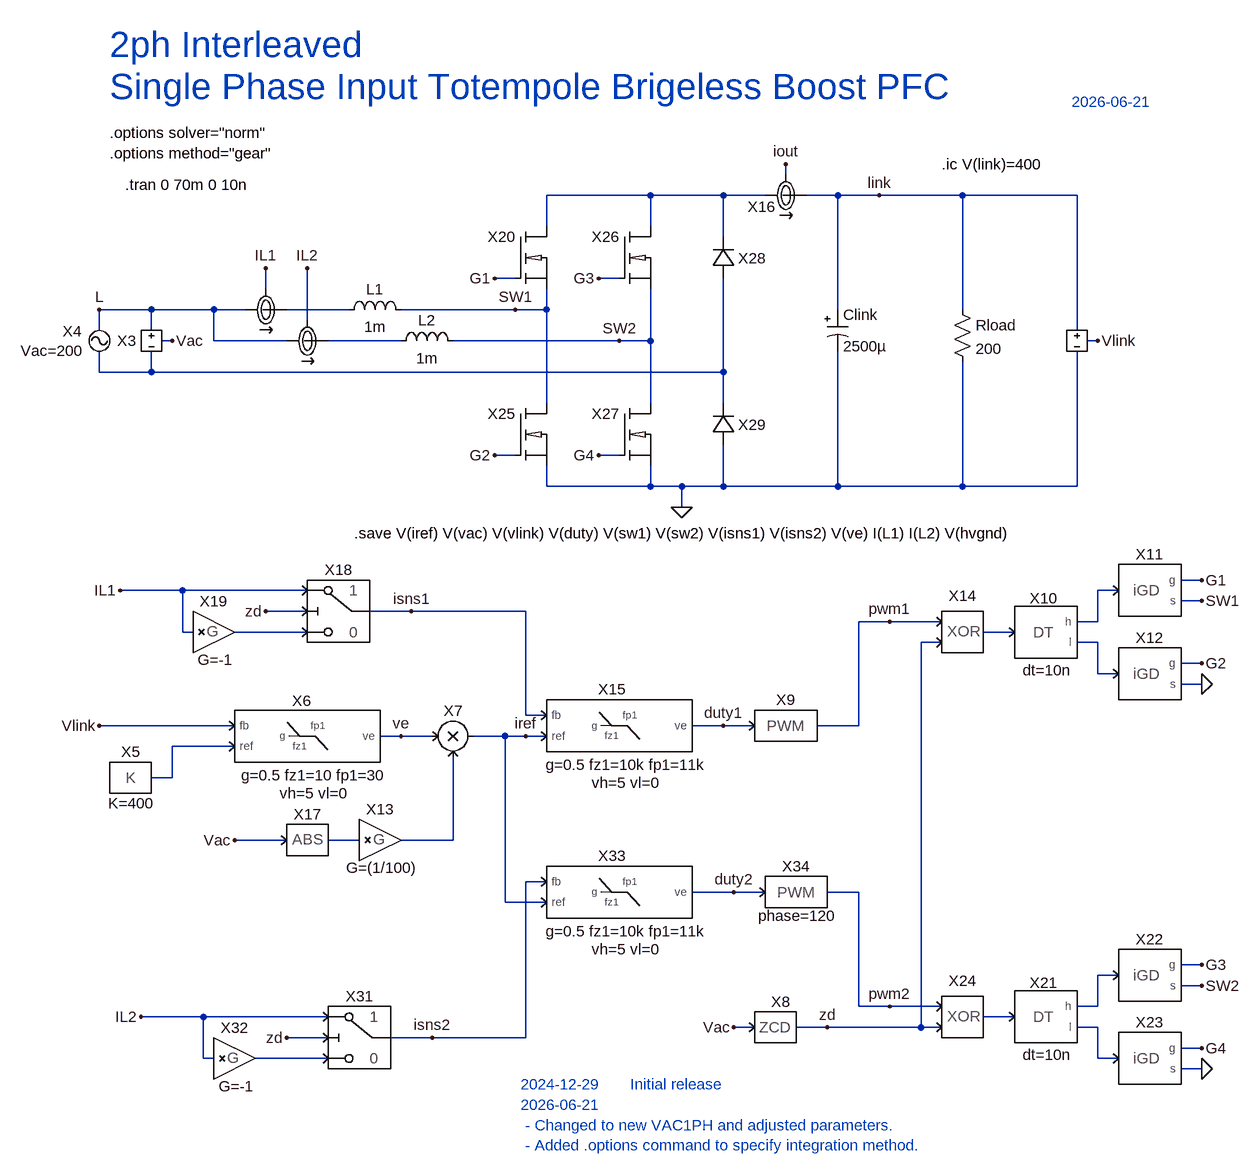
[diagram p0: schematic 1Ph-TTP-PFC_2ITLV.asc]
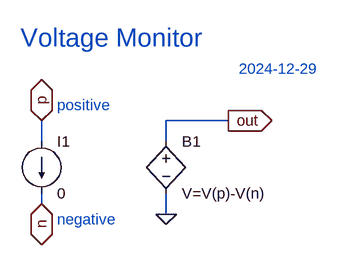
[diagram p1: sub-circuit vmon.asc]
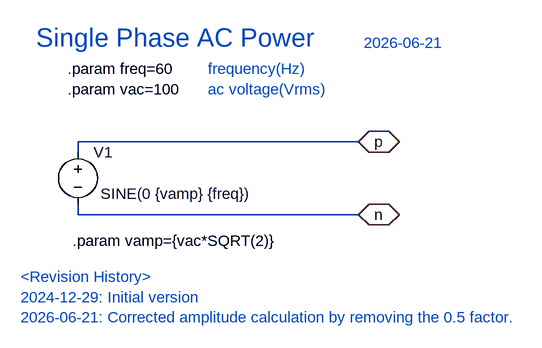
[diagram p2: sub-circuit vac1ph.asc]
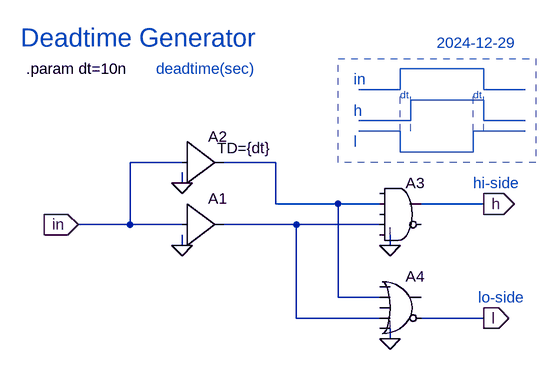
[diagram p3: sub-circuit deadtime.asc]
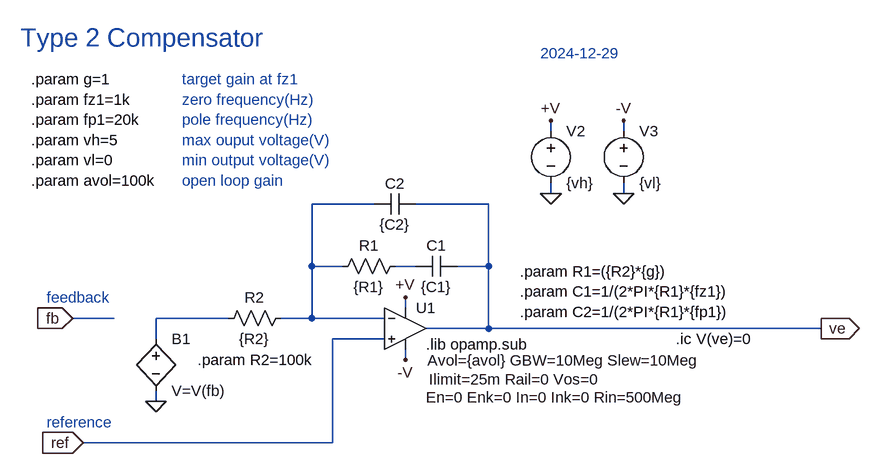
[diagram p4: sub-circuit type2.asc]
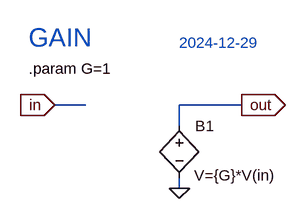
[diagram p5: sub-circuit gain.asc]
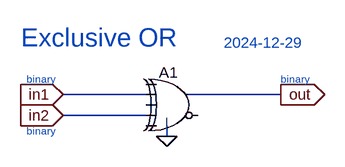
[diagram p6: sub-circuit exor.asc]
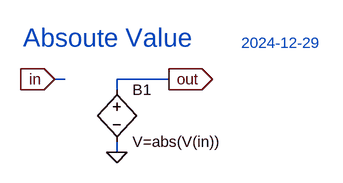
[diagram p7: sub-circuit abs.asc]
1Ph-TTP-PFC_2ITLV.asc, the LTspice schematic file:
Version 4.1
SHEET 1 1940 1460
WIRE 800 -48 800 -64
WIRE 592 -16 432 -16
WIRE 704 -16 592 -16
WIRE 768 -16 704 -16
WIRE 880 -16 832 -16
WIRE 944 -16 880 -16
WIRE 1072 -16 944 -16
WIRE 1248 -16 1072 -16
WIRE 432 32 432 -16
WIRE 592 32 592 -16
WIRE 704 48 704 -16
WIRE 384 112 352 112
WIRE 544 112 512 112
WIRE 0 128 0 96
WIRE -176 160 -256 160
WIRE -80 160 -176 160
WIRE -32 160 -80 160
WIRE 128 160 32 160
WIRE 384 160 208 160
WIRE 432 160 432 128
WIRE 432 160 384 160
WIRE 880 160 880 -16
WIRE 1072 160 1072 -16
WIRE 64 176 64 96
WIRE -256 192 -256 160
WIRE -176 192 -176 160
WIRE 1248 192 1248 -16
WIRE -144 208 -160 208
WIRE -80 208 -80 160
WIRE 32 208 -80 208
WIRE 208 208 96 208
WIRE 544 208 288 208
WIRE 592 208 592 128
WIRE 592 208 544 208
WIRE 1280 208 1264 208
WIRE -256 256 -256 224
WIRE -176 256 -176 224
WIRE -176 256 -256 256
WIRE 704 256 704 112
WIRE 704 256 -176 256
WIRE 432 304 432 160
WIRE 592 304 592 208
WIRE 704 304 704 256
WIRE 384 384 352 384
WIRE 544 384 512 384
WIRE 432 432 432 400
WIRE 592 432 592 400
WIRE 592 432 432 432
WIRE 640 432 592 432
WIRE 704 432 704 368
WIRE 704 432 640 432
WIRE 880 432 880 224
WIRE 880 432 704 432
WIRE 1072 432 1072 240
WIRE 1072 432 880 432
WIRE 1248 432 1248 224
WIRE 1248 432 1072 432
WIRE 640 464 640 432
WIRE 1440 576 1408 576
WIRE -128 592 -224 592
WIRE 64 592 -128 592
WIRE 1312 592 1280 592
WIRE 1440 608 1408 608
WIRE 64 624 0 624
WIRE 224 624 160 624
WIRE 400 624 224 624
WIRE 960 640 912 640
WIRE 1040 640 960 640
WIRE 1280 640 1280 592
WIRE 1280 640 1248 640
WIRE -128 656 -128 592
WIRE -112 656 -128 656
WIRE 64 656 -48 656
WIRE 1152 656 1104 656
WIRE 1040 672 1008 672
WIRE 1280 672 1248 672
WIRE 1440 704 1408 704
WIRE 1280 720 1280 672
WIRE 1312 720 1280 720
WIRE 1440 736 1408 736
WIRE 400 784 400 624
WIRE 432 784 400 784
WIRE -48 800 -256 800
WIRE 704 800 656 800
WIRE 752 800 704 800
WIRE 912 800 912 640
WIRE 912 800 848 800
WIRE 208 816 176 816
WIRE 256 816 208 816
WIRE 368 816 320 816
WIRE 400 816 368 816
WIRE 432 816 400 816
WIRE -48 832 -144 832
WIRE -144 880 -144 832
WIRE -144 880 -176 880
WIRE 32 976 -48 976
WIRE 144 976 96 976
WIRE 288 976 288 848
WIRE 288 976 208 976
WIRE 432 1040 400 1040
WIRE 720 1056 656 1056
WIRE 768 1056 720 1056
WIRE 912 1056 864 1056
WIRE 368 1072 368 816
WIRE 432 1072 368 1072
WIRE 1440 1168 1408 1168
WIRE 1312 1184 1280 1184
WIRE 1440 1200 1408 1200
WIRE 912 1232 912 1056
WIRE 960 1232 912 1232
WIRE 1040 1232 960 1232
WIRE 1280 1232 1280 1184
WIRE 1280 1232 1248 1232
WIRE -96 1248 -192 1248
WIRE 96 1248 -96 1248
WIRE 1152 1248 1104 1248
WIRE 752 1264 720 1264
WIRE 864 1264 816 1264
WIRE 1008 1264 1008 672
WIRE 1008 1264 864 1264
WIRE 1040 1264 1008 1264
WIRE 1280 1264 1248 1264
WIRE 96 1280 32 1280
WIRE 256 1280 192 1280
WIRE 400 1280 400 1040
WIRE 400 1280 256 1280
WIRE 1440 1296 1408 1296
WIRE -96 1312 -96 1248
WIRE -80 1312 -96 1312
WIRE 96 1312 -16 1312
WIRE 1280 1312 1280 1264
WIRE 1312 1312 1280 1312
WIRE 1440 1328 1408 1328
FLAG 352 112 G1
FLAG 352 384 G2
FLAG 384 160 SW1
FLAG 944 -16 link
FLAG -256 160 L
FLAG 0 96 IL1
FLAG 1280 208 Vlink
FLAG -144 208 Vac
FLAG -256 800 Vlink
FLAG -48 976 Vac
FLAG -224 592 IL1
FLAG 1440 576 G1
FLAG 1440 608 SW1
FLAG 1440 704 G2
FLAG 720 1264 Vac
FLAG 400 816 iref
FLAG 224 624 isns1
FLAG 704 800 duty1
FLAG 864 1264 zd
FLAG 0 624 zd
FLAG 640 464 0
FLAG 800 -64 iout
FLAG 208 816 ve
FLAG 1440 1168 G3
FLAG 1440 1200 SW2
FLAG 1440 1296 G4
FLAG 512 112 G3
FLAG 512 384 G4
FLAG 544 208 SW2
FLAG 960 640 pwm1
FLAG 960 1232 pwm2
FLAG 64 96 IL2
FLAG -192 1248 IL2
FLAG 256 1280 isns2
FLAG 32 1280 zd
FLAG 720 1056 duty2
FLAG 1440 736 0
FLAG 1440 1328 0
SYMBOL ind 112 176 R270
WINDOW 0 32 56 VTop 2
WINDOW 3 5 56 VBottom 2
SYMATTR InstName L1
SYMATTR Value 1m
SYMATTR SpiceLine Rser=1m
SYMBOL polcap 864 160 R0
WINDOW 3 24 56 Left 2
SYMATTR Value 2500µ
SYMATTR InstName Clink
SYMATTR Description Capacitor
SYMATTR Type cap
SYMATTR SpiceLine Rser=10m
SYMBOL res 1056 144 R0
SYMATTR InstName Rload
SYMATTR Value 200
SYMBOL IMON 0 160 M180
WINDOW 0 0 -26 Invisible 2
SYMATTR InstName X1
SYMBOL VMON 1248 208 R0
WINDOW 0 57 -5 Invisible 2
SYMATTR InstName X2
SYMBOL VAC1ph -256 208 R0
WINDOW 39 -25 15 Right 2
WINDOW 0 -27 -15 Right 2
SYMATTR SpiceLine Vac=200
SYMATTR InstName X4
SYMBOL DEADTIME 1200 656 R0
WINDOW 0 -3 -68 Top 2
WINDOW 39 2 43 Top 2
SYMATTR InstName X10
SYMBOL CONST -208 880 R0
WINDOW 39 1 55 Bottom 2
SYMATTR SpiceLine K=400
SYMATTR InstName X5
SYMBOL VMON -176 208 R0
WINDOW 0 -23 0 Right 2
SYMATTR InstName X3
SYMBOL iGD 1360 592 R0
SYMATTR InstName X11
SYMBOL iGD 1360 720 R0
SYMATTR InstName X12
SYMBOL IMON 800 -16 M180
SYMATTR InstName X16
SYMBOL TYPE2 64 816 R0
WINDOW 0 -9 -54 Center 2
WINDOW 39 10 60 Center 2
WINDOW 40 10 88 Center 2
SYMATTR InstName X6
SYMATTR SpiceLine g=0.5 fz1=10 fp1=30
SYMBOL TYPE2 544 800 R0
WINDOW 0 -11 -56 Center 2
WINDOW 39 10 60 Center 2
WINDOW 40 10 88 Center 2
SYMATTR InstName X15
SYMATTR SpiceLine g=0.5 fz1=10k fp1=11k
SYMBOL ZCD 784 1264 R0
SYMATTR InstName X8
SYMBOL GAIN 176 976 R0
WINDOW 39 3 58 Bottom 2
SYMATTR SpiceLine G=(1/100)
SYMATTR InstName X13
SYMBOL EXOR 1072 656 R0
WINDOW 0 0 -40 Bottom 2
SYMATTR InstName X14
SYMBOL ABS 64 976 R0
SYMATTR InstName X17
SYMBOL DEADTIME 1200 1248 R0
WINDOW 0 -3 -68 Top 2
WINDOW 39 2 43 Top 2
SYMATTR InstName X21
SYMBOL iGD 1360 1184 R0
SYMATTR InstName X22
SYMBOL iGD 1360 1312 R0
SYMATTR InstName X23
SYMBOL EXOR 1072 1248 R0
WINDOW 0 0 -40 Bottom 2
SYMATTR InstName X24
SYMBOL ind 192 224 R270
WINDOW 0 32 56 VTop 2
WINDOW 3 5 56 VBottom 2
SYMATTR InstName L2
SYMATTR Value 1m
SYMATTR SpiceLine Rser=1m
SYMBOL GAIN -80 656 R0
WINDOW 39 3 58 Bottom 2
SYMATTR SpiceLine G=-1
SYMATTR InstName X19
SYMBOL MUL 288 816 R0
SYMATTR InstName X7
SYMBOL iNMOS 432 80 R0
SYMATTR InstName X20
SYMBOL iNMOS 432 352 R0
SYMATTR InstName X25
SYMBOL iNMOS 592 80 R0
SYMATTR InstName X26
SYMBOL iNMOS 592 352 R0
SYMATTR InstName X27
SYMBOL iD 704 80 R180
SYMATTR InstName X28
SYMBOL iD 704 336 R180
SYMATTR InstName X29
SYMBOL IMON 64 208 M180
WINDOW 0 0 -26 Invisible 2
SYMATTR InstName X30
SYMBOL PWM 800 800 R0
SYMATTR InstName X9
SYMBOL GAIN -48 1312 R0
WINDOW 39 3 58 Bottom 2
SYMATTR SpiceLine G=-1
SYMATTR InstName X32
SYMBOL TYPE2 544 1056 R0
WINDOW 0 -11 -56 Center 2
WINDOW 39 10 60 Center 2
WINDOW 40 10 88 Center 2
SYMATTR InstName X33
SYMATTR SpiceLine g=0.5 fz1=10k fp1=11k
SYMBOL PWM 816 1056 R0
WINDOW 40 2 52 Bottom 2
SYMATTR SpiceLine2 phase=120
SYMATTR InstName X34
SYMBOL MUX 112 624 R0
SYMATTR InstName X18
SYMBOL MUX 144 1280 R0
SYMATTR InstName X31
TEXT -240 -184 Left 5 ;Single Phase Input Totempole Brigeless Boost PFC
TEXT -216 -32 Left 2 !.tran 0 70m 0 10n
TEXT 1040 -64 Left 2 !.ic V(link)=400
TEXT 136 504 Left 2 !.save V(iref) V(vac) V(vlink) V(duty) V(sw1) V(sw2) V(isns1) V(isns2) V(ve) I(L1) I(L2) V(hvgnd)
TEXT 1240 -160 Left 2 ;2026-06-21
TEXT -240 -248 Left 5 ;2ph Interleaved
TEXT 392 1352 Left 2 ;2024-12-29       Initial release\n2026-06-21       \n - Changed to new VAC1PH and adjusted parameters.\n - Added .options command to specify integration method.
TEXT -240 -112 Left 2 !.options solver="norm"\n.options method="gear"

vmon.asc, the sub-circuit schematic file:
Version 4
SHEET 1 880 680
WIRE 176 -32 80 -32
WIRE -112 0 -112 -32
WIRE 80 0 80 -32
WIRE -112 96 -112 80
WIRE 80 112 80 80
FLAG -112 -32 p
IOPIN -112 -32 BiDir
FLAG -112 96 n
IOPIN -112 96 BiDir
FLAG 176 -32 out
IOPIN 176 -32 Out
FLAG 80 112 0
SYMBOL bv 80 -16 R0
SYMATTR InstName B1
SYMATTR Value V=V(p)-V(n)
SYMBOL current -112 0 R0
WINDOW 123 0 0 Left 0
WINDOW 39 0 0 Left 0
SYMATTR InstName I1
SYMATTR Value 0
TEXT -144 -160 Left 4 ;Voltage Monitor
TEXT -88 -56 Left 2 ;positive
TEXT -88 120 Left 2 ;negative
TEXT 192 -112 Left 2 ;2024-12-29

vac1ph.asc, the sub-circuit schematic file:
Version 4.1
SHEET 1 1308 680
WIRE 496 112 64 112
WIRE 64 128 64 112
WIRE 64 224 64 208
WIRE 496 224 64 224
FLAG 496 112 p
IOPIN 496 112 BiDir
FLAG 496 224 n
IOPIN 496 224 BiDir
SYMBOL voltage 64 112 R0
WINDOW 3 35 80 Left 2
WINDOW 123 0 0 Left 0
WINDOW 39 0 0 Left 0
SYMATTR Value SINE(0 {vamp} {freq})
SYMATTR InstName V1
TEXT 48 0 Left 2 !.param freq=60\n.param vac=100
TEXT 0 -48 Left 4 ;Single Phase AC Power
TEXT 264 0 Left 2 ;frequency(Hz)\nac voltage(Vrms)
TEXT 56 264 Left 2 !.param vamp={vac*SQRT(2)}
TEXT 504 -40 Left 2 ;2026-06-21
TEXT -24 320 Left 2 ;<Revision History>\n2024-12-29: Initial version\n2026-06-21: Corrected amplitude calculation by removing the 0.5 factor.

deadtime.asc, the sub-circuit schematic file:
Version 4
SHEET 1 1412 1312
WIRE 64 288 -16 288
WIRE 208 288 128 288
WIRE 64 320 64 304
WIRE 208 352 208 288
WIRE 304 352 208 352
WIRE 368 352 304 352
WIRE 528 352 432 352
WIRE -16 384 -16 288
WIRE -16 384 -96 384
WIRE 64 384 -16 384
WIRE 240 384 128 384
WIRE 368 384 240 384
WIRE 64 416 64 400
WIRE 384 416 384 400
WIRE 304 496 304 352
WIRE 368 496 304 496
WIRE 240 528 240 384
WIRE 368 528 240 528
WIRE 528 528 432 528
WIRE 384 560 384 544
FLAG -96 384 in
IOPIN -96 384 In
FLAG 64 416 0
FLAG 64 320 0
FLAG 384 416 0
FLAG 384 560 0
FLAG 528 352 h
IOPIN 528 352 Out
FLAG 528 528 l
IOPIN 528 528 Out
SYMBOL Digital\\buf1 64 320 R0
SYMATTR InstName A1
SYMBOL Digital\\buf1 64 224 R0
WINDOW 3 54 42 Left 2
SYMATTR Value TD={dt}
SYMATTR InstName A2
SYMBOL Digital\\and 400 304 R0
SYMATTR InstName A3
SYMBOL Digital\\or 400 448 R0
SYMATTR InstName A4
TEXT -176 144 Left 2 !.param dt=10n
TEXT -184 96 Left 4 ;Deadtime Generator
TEXT 24 144 Left 2 ;deadtime(sec)
TEXT 512 320 Left 2 ;hi-side
TEXT 520 496 Left 2 ;lo-side
TEXT 328 160 Left 2 ;in
TEXT 328 208 Left 2 ;h
TEXT 328 256 Left 2 ;l
TEXT 400 184 Left 1 ;dt
TEXT 512 184 Left 1 ;dt
TEXT 456 104 Left 2 ;2024-12-29
LINE Normal 400 176 336 176
LINE Normal 400 176 400 144
LINE Normal 528 144 400 144
LINE Normal 528 176 528 144
LINE Normal 592 176 528 176
LINE Normal 416 224 336 224
LINE Normal 416 224 416 192
LINE Normal 528 192 416 192
LINE Normal 528 224 528 192
LINE Normal 592 224 528 224
LINE Normal 400 240 336 240
LINE Normal 400 272 400 240
LINE Normal 512 272 400 272
LINE Normal 512 272 512 240
LINE Normal 592 240 512 240
LINE Normal 400 240 400 176 2
LINE Normal 512 240 512 176 2
LINE Normal 416 240 416 176 2
LINE Normal 528 240 528 176 2
RECTANGLE Normal 608 288 304 128 2

type2.asc, the sub-circuit schematic file:
Version 4
SHEET 1 1008 680
WIRE 464 -144 464 -160
WIRE 576 -144 576 -160
WIRE 464 -48 464 -64
WIRE 576 -48 576 -64
WIRE 192 -32 96 -32
WIRE 368 -32 256 -32
WIRE 96 64 96 -32
WIRE 144 64 96 64
WIRE 256 64 224 64
WIRE 368 64 368 -32
WIRE 368 64 320 64
WIRE 240 128 240 112
WIRE -208 144 -272 144
WIRE -32 144 -144 144
WIRE 96 144 96 64
WIRE 96 144 48 144
WIRE 208 144 96 144
WIRE 368 160 368 64
WIRE 368 160 272 160
WIRE 880 160 368 160
WIRE -144 176 -144 144
WIRE 208 176 128 176
WIRE 240 208 240 192
WIRE -144 272 -144 256
WIRE 128 336 128 176
WIRE 128 336 -256 336
FLAG -272 144 fb
IOPIN -272 144 In
FLAG -256 336 ref
IOPIN -256 336 In
FLAG -144 272 0
FLAG 880 160 ve
IOPIN 880 160 Out
FLAG 576 -48 0
FLAG 464 -48 0
FLAG 464 -160 +V
FLAG 576 -160 -V
FLAG 240 112 +V
FLAG 240 208 -V
SYMBOL res 240 48 R90
WINDOW 0 0 56 VBottom 2
WINDOW 3 32 56 VTop 2
SYMATTR InstName R1
SYMATTR Value {R1}
SYMBOL cap 320 48 R90
WINDOW 0 0 32 VBottom 2
WINDOW 3 32 32 VTop 2
SYMATTR InstName C1
SYMATTR Value {C1}
SYMBOL cap 256 -48 R90
WINDOW 0 0 32 VBottom 2
WINDOW 3 32 32 VTop 2
SYMATTR InstName C2
SYMATTR Value {C2}
SYMBOL bv -144 160 R0
SYMATTR InstName B1
SYMATTR Value V=V(fb)
SYMBOL res 64 128 R90
WINDOW 0 0 56 VBottom 2
WINDOW 3 32 56 VTop 2
SYMATTR InstName R2
SYMATTR Value {R2}
SYMBOL UniversalOpAmp2 240 160 R0
WINDOW 123 34 49 Left 2
WINDOW 39 36 78 Left 2
WINDOW 40 32 106 Left 2
SYMATTR Value2 Avol={avol} GBW=10Meg Slew=10Meg
SYMATTR InstName U1
SYMBOL voltage 464 -160 R0
SYMATTR InstName V2
SYMATTR Value {vh}
SYMBOL voltage 576 -160 R0
SYMATTR InstName V3
SYMATTR Value {vl}
TEXT 272 184 Left 2 !.lib opamp.sub
TEXT -336 -224 Left 2 !.param g=1\n.param fz1=1k\n.param fp1=20k\n.param vh=5\n.param vl=0\n.param avol=100k
TEXT 416 72 Left 2 !.param R1=({R2}*{g})\n.param C1=1/(2*PI*{R1}*{fz1})\n.param C2=1/(2*PI*{R1}*{fp1})
TEXT -352 -288 Left 4 ;Type 2 Compensator
TEXT -80 208 Left 2 !.param R2=100k
TEXT -104 -224 Left 2 ;target gain at fz1\nzero frequency(Hz)\npole frequency(Hz)\nmax ouput voltage(V)\nmin output voltage(V)\nopen loop gain
TEXT -312 112 Left 2 ;feedback
TEXT -312 304 Left 2 ;reference
TEXT 656 176 Left 2 !.ic V(ve)=0
TEXT 448 -264 Left 2 ;2024-12-29

gain.asc, the sub-circuit schematic file:
Version 4
SHEET 1 880 680
WIRE 0 64 -48 64
WIRE 240 64 144 64
WIRE 144 96 144 64
WIRE 144 192 144 176
FLAG 144 192 0
FLAG 240 64 out
IOPIN 240 64 Out
FLAG -48 64 in
IOPIN -48 64 In
SYMBOL bv 144 80 R0
WINDOW 3 23 92 Left 2
SYMATTR Value V={G}*V(in)
SYMATTR InstName B1
TEXT -88 8 Left 2 !.param G=1
TEXT -88 -40 Left 4 ;GAIN
TEXT 144 -32 Left 2 ;2024-12-29

exor.asc, the sub-circuit schematic file:
Version 4
SHEET 1 880 680
WIRE 160 128 32 128
WIRE 368 128 224 128
WIRE 160 160 32 160
WIRE 192 192 192 176
FLAG 192 192 0
FLAG 32 128 in1
IOPIN 32 128 In
FLAG 32 160 in2
IOPIN 32 160 In
FLAG 368 128 out
IOPIN 368 128 Out
SYMBOL Digital\\xor 208 80 R0
WINDOW 0 -28 14 Left 2
SYMATTR InstName A1
TEXT -24 104 Left 1 ;binary
TEXT -24 184 Left 1 ;binary
TEXT 368 104 Left 1 ;binary
TEXT -32 40 Left 4 ;Exclusive OR
TEXT 280 48 Left 2 ;2024-12-29

abs.asc, the sub-circuit schematic file:
Version 4
SHEET 1 880 680
WIRE 80 128 64 128
WIRE 240 128 160 128
WIRE 160 144 160 128
WIRE 160 240 160 224
FLAG 64 128 in
IOPIN 64 128 In
FLAG 160 240 0
FLAG 240 128 out
IOPIN 240 128 Out
SYMBOL bv 160 128 R0
SYMATTR InstName B1
SYMATTR Value V=abs(V(in))
TEXT 16 64 Left 4 ;Absoute Value
TEXT 352 72 Left 2 ;2024-12-29

mul.asc, the sub-circuit schematic file:
Version 4
SHEET 1 880 680
WIRE 96 48 48 48
WIRE 320 48 240 48
WIRE 96 64 96 48
WIRE 240 64 240 48
WIRE 96 160 96 144
WIRE 240 160 240 144
WIRE 96 208 48 208
WIRE 96 224 96 208
WIRE 96 320 96 304
FLAG 48 48 IN1
IOPIN 48 48 In
FLAG 48 208 IN2
IOPIN 48 208 In
FLAG 240 160 0
FLAG 320 48 OUT
IOPIN 320 48 Out
FLAG 96 160 0
FLAG 96 320 0
SYMBOL bv 240 48 R0
SYMATTR InstName B1
SYMATTR Value V=V(IN1)*V(IN2)
SYMBOL res 80 48 R0
SYMATTR InstName R1
SYMATTR Value 1Meg
SYMBOL res 80 208 R0
SYMATTR InstName R2
SYMATTR Value 1Meg
TEXT -16 -56 Left 4 ;Multiplier

pwm.asc, the sub-circuit schematic file:
Version 4.1
SHEET 1 1668 1312
WIRE 32 64 -96 64
WIRE 432 80 416 80
WIRE 480 80 432 80
WIRE 576 80 480 80
WIRE 704 80 640 80
WIRE 480 96 480 80
WIRE 576 112 576 96
WIRE 32 160 -96 160
WIRE 480 208 480 176
WIRE -96 272 -96 160
WIRE -96 384 -96 352
FLAG -96 64 duty
IOPIN -96 64 In
FLAG 704 80 pwm
IOPIN 704 80 Out
FLAG 480 208 0
FLAG 432 80 c
FLAG 576 112 0
FLAG -96 384 0
FLAG -96 160 saw
SYMBOL res 464 80 R0
SYMATTR InstName R2
SYMATTR Value 1k
SYMBOL Digital\\buf1 576 16 R0
SYMATTR InstName A1
SYMBOL voltage -96 256 R0
WINDOW 123 0 0 Left 0
WINDOW 39 0 0 Left 0
SYMATTR InstName V1
SYMATTR Value PULSE(0 1 {phase/(360*freq)} {IF(tri==0,1/freq-1n,1/(2*freq))} {IF(tri==0,0.5n,1/(2*freq))} {IF(tri==0,0.5n,0)} {1/freq})
TEXT 72 32 Left 2 !.machine\n.state LO 0\n.state HI 1\n.rule HI LO V(saw)>V(duty)\n.rule LO HI V(saw)< V(duty)\n.output (c) state\n.endmachine
TEXT -144 -120 Left 2 !.param freq=100k
TEXT 624 120 Left 2 !.ic V(pwm)=0
TEXT -144 -88 Left 2 !.param phase=0
TEXT -144 -168 Left 4 ;Pulse Width Modulator
TEXT 464 -168 Left 2 ;2026-09-21
TEXT 104 -120 Left 2 ;frequency(Hz)
TEXT -144 -56 Left 2 !.param tri=0
TEXT 104 -56 Left 2 ;0: Saw, 1; Triangular
TEXT 104 -88 Left 2 ;phase(deg)
TEXT -96 448 Left 2 ;<Revision History>\n2024-12-29: Initial version\n2026-09-21: Added tri parameter to select a triangular carrier (tri=1) or retain the original sawtooth carrier (tri=0, default).
RECTANGLE Normal 416 240 32 0 2

mux.asc, the sub-circuit schematic file:
Version 4
SHEET 1 880 680
WIRE 336 16 208 16
WIRE 128 32 96 32
WIRE 208 48 208 16
WIRE 128 80 96 80
WIRE 128 144 96 144
WIRE 208 160 208 128
FLAG 96 32 in1
IOPIN 96 32 In
FLAG 96 80 in2
IOPIN 96 80 In
FLAG 96 144 sel
IOPIN 96 144 In
FLAG 336 16 out
IOPIN 336 16 Out
FLAG 208 160 0
SYMBOL bv 208 32 R0
SYMATTR InstName B1
SYMATTR Value V=IF(V(sel)>0.5,V(in1),V(in2))
TEXT 24 -40 Left 2 ;2-1 Multiplexer
TEXT 40 120 Left 1 ;binary
TEXT 40 168 Left 1 ;1: out=in1\n0: out=in2

The netlist it stands for:
* 1Ph-TTP-PFC_2ITLV.asc
L1 N002 SW1 1m Rser=1m
Clink link 0 2500µ Rser=10m
Rload link 0 200
X§X1 N002 IL1 L IMON rsns=10u  ; pins n out p
X§X2 0 Vlink link vmon
X§X4 N004 L vac1ph params: Vac=200 freq=60
X§X10 N007 N008 N005 deadtime params: dt=10n
X§X5 N009 CONST K=400  ; pins K
X§X3 N004 Vac L vmon
X§X11 N005 G1 SW1 iGD  ; pins in g s
X§X12 N008 G2 0 iGD  ; pins in g s
X§X16 link iout N001 IMON rsns=10u  ; pins n out p
X§X6 Vlink N009 ve type2 params: avol=100k g=0.5 fz1=10 fp1=30 vh=5 vl=0
X§X15 isns1 iref duty1 type2 params: avol=100k g=0.5 fz1=10k fp1=11k vh=5 vl=0
X§X8 Vac zd ZCD params: hys=0  ; pins in zcd
X§X13 N010 N011 gain params: G=(1/100)
X§X14 pwm1 zd N007 exor
X§X17 Vac N010 abs
X§X21 N013 N014 N012 deadtime params: dt=10n
X§X22 N012 G3 SW2 iGD  ; pins in g s
X§X23 N014 G4 0 iGD  ; pins in g s
X§X24 pwm2 zd N013 exor
L2 N003 SW2 1m Rser=1m
X§X19 IL1 N006 gain params: G=-1
X§X7 ve N011 iref mul
X§X20 N001 G1 SW1 iNMOS params: esl=1f rsnb=1k csnb=10p ron=10m  ; pins D G S
X§X25 SW1 G2 0 iNMOS params: esl=1f rsnb=1k csnb=10p ron=10m  ; pins D G S
X§X26 N001 G3 SW2 iNMOS params: esl=1f rsnb=1k csnb=10p ron=10m  ; pins D G S
X§X27 SW2 G4 0 iNMOS params: esl=1f rsnb=1k csnb=10p ron=10m  ; pins D G S
X§X28 N004 N001 iD params: von=1n ron=10m esl=1f rsnb=1k csnb=10p  ; pins AN CA
X§X29 0 N004 iD params: von=1n ron=10m esl=1f rsnb=1k csnb=10p  ; pins AN CA
X§X30 N003 IL2 L IMON rsns=10u  ; pins n out p
X§X9 duty1 pwm1 pwm params: tri=0 freq=100k phase=0
X§X32 IL2 N015 gain params: G=-1
X§X33 isns2 iref duty2 type2 params: avol=100k g=0.5 fz1=10k fp1=11k vh=5 vl=0
X§X34 duty2 pwm2 pwm params: tri=0 freq=100k phase=120
X§X18 IL1 N006 zd isns1 mux
X§X31 IL2 N015 zd isns2 mux

* block symbol definitions
.subckt vmon n out p
B1 out 0 V=V(p)-V(n)
I1 p n 0
* Voltage Monitor
* positive
* negative
* 2024-12-29
.ends vmon

.subckt vac1ph n p
V1 p n SINE(0 {vamp} {freq})
.param freq=60
.param vac=100
* Single Phase AC Power
* frequency(Hz)
* ac voltage(Vrms)
.param vamp={vac*SQRT(2)}
* 2026-06-21
* <Revision History>
* 2024-12-29: Initial version
* 2026-06-21: Corrected amplitude calculation by removing the 0.5 factor.
.ends vac1ph

.subckt deadtime in l h
A1 in 0 0 0 0 0 N002 0 BUF
A2 in 0 0 0 0 0 N001 0 BUF TD={dt}
A3 0 N001 0 N002 0 0 h 0 AND
A4 0 N001 0 N002 0 l 0 0 OR
.param dt=10n
* Deadtime Generator
* deadtime(sec)
* hi-side
* lo-side
* in
* h
* l
* dt
* dt
* 2024-12-29
.ends deadtime

.subckt type2 fb ref ve
R1 N002 N001 {R1}
C1 ve N002 {C1}
C2 ve N001 {C2}
B1 N003 0 V=V(fb)
R2 N001 N003 {R2}
XU1 ref N001 +V -V ve level2 Avol={avol} GBW=10Meg Slew=10Meg Ilimit=25m Rail=0 Vos=0 En=0 Enk=0 In=0 Ink=0 Rin=500Meg  ; pins In+ In- V+ V- OUT
V2 +V 0 {vh}
V3 -V 0 {vl}
.lib opamp.sub
.param g=1
.param fz1=1k
.param fp1=20k
.param vh=5
.param vl=0
.param avol=100k
.param R1=({R2}*{g})
.param C1=1/(2*PI*{R1}*{fz1})
.param C2=1/(2*PI*{R1}*{fp1})
* Type 2 Compensator
.param R2=100k
* target gain at fz1
* zero frequency(Hz)
* pole frequency(Hz)
* max ouput voltage(V)
* min output voltage(V)
* open loop gain
* feedback
* reference
.ic V(ve)=0
* 2024-12-29
.ends type2

.subckt gain in out
B1 out 0 V={G}*V(in)
.param G=1
* GAIN
* 2024-12-29
.ends gain

.subckt exor in1 in2 out
A1 0 in1 0 in2 0 0 out 0 XOR
* binary
* binary
* binary
* Exclusive OR
* 2024-12-29
.ends exor

.subckt abs in out
B1 out 0 V=abs(V(in))
* Absoute Value
* 2024-12-29
.ends abs

.subckt mul in1 in2 out
B1 OUT 0 V=V(IN1)*V(IN2)
R1 IN1 0 1Meg
R2 IN2 0 1Meg
* Multiplier
.ends mul

.subckt pwm duty pwm
R2 c 0 1k
A1 c 0 0 0 0 0 pwm 0 BUF
V1 saw 0 PULSE(0 1 {phase/(360*freq)} {IF(tri==0,1/freq-1n,1/(2*freq))} {IF(tri==0,0.5n,1/(2*freq))} {IF(tri==0,0.5n,0)} {1/freq})
.machine
.state LO 0
.state HI 1
.rule HI LO V(saw)>V(duty)
.rule LO HI V(saw)< V(duty)
.output (c) state
.endmachine
.param freq=100k
.ic V(pwm)=0
.param phase=0
* Pulse Width Modulator
* 2026-09-21
* frequency(Hz)
.param tri=0
* 0: Saw, 1; Triangular
* phase(deg)
* <Revision History>
* 2024-12-29: Initial version
* 2026-09-21: Added tri parameter to select a triangular carrier (tri=1) or retain the original sawtooth carrier (tri=0, default).
.ends pwm

.subckt mux in1 in2 sel out
B1 out 0 V=IF(V(sel)>0.5,V(in1),V(in2))
* 2-1 Multiplexer
* binary
* 1: out=in1
* 0: out=in2
.ends mux

* Single Phase Input Totempole Brigeless Boost PFC
.tran 0 70m 0 10n
.ic V(link)=400
.save V(iref) V(vac) V(vlink) V(duty) V(sw1) V(sw2) V(isns1) V(isns2) V(ve) I(L1) I(L2) V(hvgnd)
* 2026-06-21
* 2ph Interleaved
* 2024-12-29       Initial release
* 2026-06-21
*  - Changed to new VAC1PH and adjusted parameters.
*  - Added .options command to specify integration method.
.options solver="norm"
.options method="gear"
.lib UniversalOpAmp2.lib
.backanno
.end